# Altium schematic sheet dmpro16-pcb-v1-FPGA-Config.SchDoc
size A4; DocumentNumber: 9; SheetNumber: 9; SheetTotal: 17; SheetName: FPGA-Config
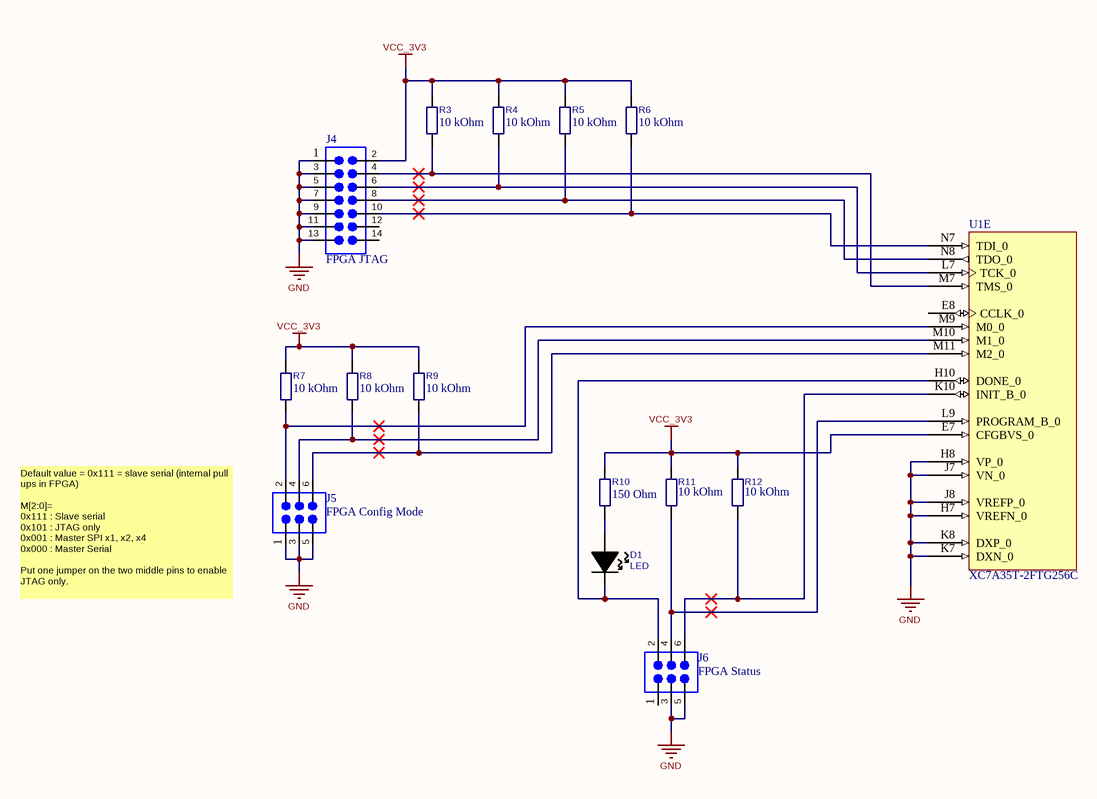
[diagram p0: dmpro16-pcb-v1-FPGA-Config.SchDoc]

## Parts
D1  LED  [LED]
J4  FPGA JTAG  [HEADER_2X7]
J5  FPGA Config Mode  [HEADER_2X3]
J6  FPGA Status  [HEADER_2X3]
R3  10 kOhm  [Resistor 2012]
R4  10 kOhm  [Resistor 2012]
R5  10 kOhm  [Resistor 2012]
R6  10 kOhm  [Resistor 2012]
R7  10 kOhm  [Resistor 2012]
R8  10 kOhm  [Resistor 2012]
R9  10 kOhm  [Resistor 2012]
R10  150 Ohm  [Resistor 2012]
R11  10 kOhm  [Resistor 2012]
R12  10 kOhm  [Resistor 2012]
U1  XC7A35T-2FTG256C  [FTG256]  (part E of 8)

## Nets
GND: J4.1 J4.3 J4.5 J4.7 J4.9 J4.11 J4.13 J5.1 J5.3 J5.5 J6.3 J6.5 U1.H7(VREFN_0) U1.H8(VP_0) U1.J7(VN_0) U1.J8(VREFP_0) U1.K7(DXN_0) U1.K8(DXP_0)
VCC_3V3: J4.2 R3.1 R4.1 R5.1 R6.1 R7.1 R8.1 R9.1 R10.1 R11.1 R12.1 U1.E7(CFGBVS_0)
NetD1_1: D1.1 J6.2 U1.H10(DONE_0)
NetD1_2: D1.2 R10.2
NetJ4_4: J4.4 R3.2 U1.M7(TMS_0)
NetJ4_6: J4.6 R4.2 U1.L7(TCK_0)
NetJ4_8: J4.8 R5.2 U1.N8(TDO_0)
NetJ4_10: J4.10 R6.2 U1.N7(TDI_0)
NetJ5_2: J5.2 R7.2 U1.M9(M0_0)
NetJ5_4: J5.4 R8.2 U1.M10(M1_0)
NetJ5_6: J5.6 R9.2 U1.M11(M2_0)
NetJ6_4: J6.4 R11.2 U1.L9(PROGRAM_B_0)
NetJ6_6: J6.6 R12.2 U1.K10(INIT_B_0)

Not connected (* = marked no-connect by the designer): J4 12 14; J6 1; U1 E8(CCLK_0)

## Notes on the sheet
- (near J5) Default value = 0x111 = slave serial (internal pull ups in FPGA)
  M[2:0]=
  0x111 : Slave serial
  0x101 : JTAG only
  0x001 : Master SPI x1, x2, x4
  0x000 : Master Serial
  Put one jumper on the two middle pins to enable JTAG only.
- Board:
- Version:
- Sheetname:
- Subject:
- Group:
- Sheet
- of
- Shematic file:

## Library data of the parts
D1 = disp_led
J4 = con_head_2x07pin: Header 2x07pin
J5 J6 = con_head_2x03pin: Header 2x03pin
R3-R9 R11 R12 = res_1608_10kohm: 10 kOhm resistor (1608 metric); Watt rating: ? mW; Value: 10 kOhm
R10 = res_1608_150ohm: 150 Ohm resistor (1608 metric); Watt rating: ? mW; Value: 150 Ohm
U1 = XC7A35T-2FTG256C: Artix-7 FPGA, 170 User I/Os, 0 GTP, 256-Ball BGA, Speed Grade 2, Commercial Grade, Pb-Free; Manufacturer: Xilinx; Total Block RAM: 1800 Kb; GTP: 0; Clock Mgmt Tiles (CMTs): 5; Logic Cells: 33280; Available User I/O: 170; Speed Grades: 2; DatasheetVersion: v1.15; PackageVersion: Rev. 1.11; PackageReference: FTG-256; PackageDescription: 256-Ball Wire-Bond Fine-Pitch Thin BGA, Body 17 x 17 mm, Pitch 1 mm; Maximum Distributed RAM: 400 Kb; Operating Temperature Range: Commercial; NexusDeviceID: XC7A35T-2FTG256C; Mounting Technology: Surface Mount; PartNumber: XC7A35T-2FTG256C; ComponentLink1Description: Manufacturer URL; ComponentLink1URL: http://www.xilinx.com/; ComponentLink2Description: Datasheet; ComponentLink2URL: http://www.xilinx.com/support/documentation/data_sheets/ds180_7Series_Overview.pdf; ComponentLink3Description: Package Specification; ComponentLink3URL: http://www.xilinx.com/support/documentation/user_guides/ug475_7Series_Pkg_Pinout.pdf; ComponentLink4Description: DC and Switching Characteristics; ComponentLink4URL: http://www.xilinx.com/support/documentation/data_sheets/ds181_Artix_7_Data_Sheet.pdf; ComponentLink5Description: Package File; ComponentLink5URL: http://www.xilinx.com/support/packagefiles/a7packages/xc7a200tsbg484pkg.txt; ComponentLink6Description: Packaging and Pinout; ComponentLink6URL: http://www.xilinx.com/support/documentation/user_guides/ug475_7Series_Pkg_Pinout.pdf